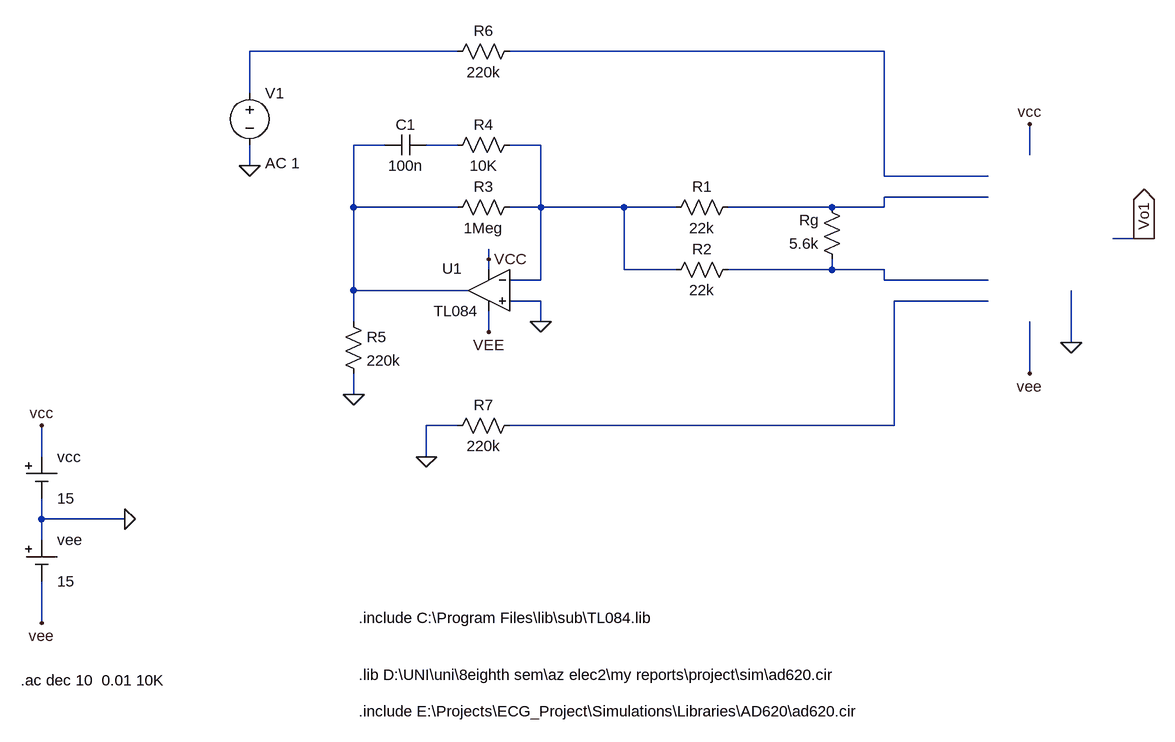
[diagram p0: schematic RLD_preamp.asc]
RLD_preamp.asc, the LTspice schematic file:
Version 4
SHEET 1 1268 1024
WIRE -112 -128 -432 -128
WIRE 544 -128 -32 -128
WIRE -432 -64 -432 -128
WIRE -224 16 -272 16
WIRE -112 16 -160 16
WIRE 16 16 -32 16
WIRE 768 32 768 -16
WIRE -432 48 -432 16
WIRE 544 64 544 -128
WIRE 704 64 544 64
WIRE 704 96 544 96
WIRE -272 112 -272 16
WIRE -112 112 -272 112
WIRE 16 112 16 16
WIRE 16 112 -32 112
WIRE 144 112 16 112
WIRE 224 112 144 112
WIRE 464 112 304 112
WIRE 544 112 544 96
WIRE 544 112 464 112
WIRE 944 160 896 160
WIRE 960 160 944 160
WIRE -64 192 -64 176
WIRE -64 208 -64 192
WIRE 144 208 144 112
WIRE 224 208 144 208
WIRE 464 208 464 192
WIRE 464 208 304 208
WIRE 544 208 464 208
WIRE 16 224 16 112
WIRE 16 224 -32 224
WIRE 544 224 544 208
WIRE 704 224 544 224
WIRE -272 240 -272 112
WIRE -96 240 -272 240
WIRE 16 256 -32 256
WIRE 704 256 560 256
WIRE -272 288 -272 240
WIRE 16 288 16 256
WIRE -64 304 -64 272
WIRE 832 320 832 240
WIRE 768 368 768 288
WIRE -272 400 -272 368
WIRE -112 448 -160 448
WIRE 560 448 560 256
WIRE 560 448 -32 448
WIRE -752 496 -752 448
WIRE -160 496 -160 448
WIRE -752 592 -752 560
WIRE -624 592 -752 592
WIRE -752 624 -752 592
WIRE -752 752 -752 688
FLAG -272 400 0
FLAG -160 496 0
FLAG 768 -16 vcc
FLAG 768 368 vee
FLAG -624 592 0
FLAG -752 448 vcc
FLAG -752 752 vee
FLAG -64 192 VCC
FLAG -64 304 VEE
FLAG 16 288 0
FLAG -432 48 0
FLAG 832 320 0
FLAG 944 160 Vo1
IOPIN 944 160 Out
SYMBOL res 320 96 R90
WINDOW 0 0 56 VBottom 2
WINDOW 3 32 56 VTop 2
SYMATTR InstName R1
SYMATTR Value 22k
SYMBOL res 320 192 R90
WINDOW 0 0 56 VBottom 2
WINDOW 3 32 56 VTop 2
SYMATTR InstName R2
SYMATTR Value 22k
SYMBOL res 480 208 R180
WINDOW 0 36 76 Left 2
WINDOW 3 36 40 Left 2
SYMATTR InstName Rg
SYMATTR Value 5.6k
SYMBOL res -16 96 R90
WINDOW 0 0 56 VBottom 2
WINDOW 3 32 56 VTop 2
SYMATTR InstName R3
SYMATTR Value 1Meg
SYMBOL res -16 -144 R90
WINDOW 0 0 56 VBottom 2
WINDOW 3 32 56 VTop 2
SYMATTR InstName R6
SYMATTR Value 220k
SYMBOL res -16 432 R90
WINDOW 0 0 56 VBottom 2
WINDOW 3 32 56 VTop 2
SYMATTR InstName R7
SYMATTR Value 220k
SYMBOL res -16 0 R90
WINDOW 0 0 56 VBottom 2
WINDOW 3 32 56 VTop 2
SYMATTR InstName R4
SYMATTR Value 10K
SYMBOL cap -160 0 R90
WINDOW 0 0 32 VBottom 2
WINDOW 3 32 32 VTop 2
SYMATTR InstName C1
SYMATTR Value 100n
SYMBOL res -288 272 R0
SYMATTR InstName R5
SYMATTR Value 220k
SYMBOL OpAmps\\opamp2 -64 176 M0
WINDOW 0 41 30 Left 2
SYMATTR InstName U1
SYMATTR Value TL084
SYMBOL Misc\\cell -752 496 R0
SYMATTR InstName vcc
SYMATTR Value 15
SYMBOL Misc\\cell -752 624 R0
SYMATTR InstName vee
SYMATTR Value 15
SYMBOL voltage -432 -80 R0
WINDOW 123 24 124 Left 2
WINDOW 39 0 0 Left 0
SYMATTR Value2 AC 1
SYMATTR InstName V1
SYMATTR Value ""
TEXT -784 840 Left 2 !.ac dec 10  0.01 10K
TEXT -264 744 Left 2 !.include C:\\Program Files\\lib\\sub\\TL084.lib
TEXT -264 832 Left 2 !.lib D:\\UNI\\uni\\8eighth sem\\az elec2\\my reports\\project\\sim\\ad620.cir
TEXT -264 888 Left 2 !.include E:\\Projects\\ECG_Project\\Simulations\\Libraries\\AD620\\ad620.cir

The netlist it stands for:
* RLD_preamp.asc
R1 N006 N005 22k
R2 N007 N005 22k
Rg N007 N006 5.6k
R3 N005 N003 1Meg
R6 N002 N001 220k
R7 N008 0 220k
R4 N005 N004 10K
C1 N004 N003 100n
R5 N003 0 220k
XU1 0 N005 vcc vee N003 TL084  ; pins In+ In- V+ V- OUT
vcc vcc 0 15
vee 0 vee 15
V1 N001 0 AC 1
.ac dec 10  0.01 10K
.include C:\Program Files\lib\sub\TL084.lib
.lib D:\UNI\uni\8eighth sem\az elec2\my reports\project\sim\ad620.cir
.include E:\Projects\ECG_Project\Simulations\Libraries\AD620\ad620.cir
.backanno
.end